# Altium schematic sheet SHT_6_I_Measure_07349-R5_L10.SchDoc
size B; CompanyName: Microchip Technology Inc.; Organization: Microchip Technology; Address1: 2355 West Chandler Blvd.; Address2: Chandler, AZ  85224; Address4: USA; SheetNumber: 7; SheetTotal: 9; SheetTitle: Current Measurement Front End; Time: Time
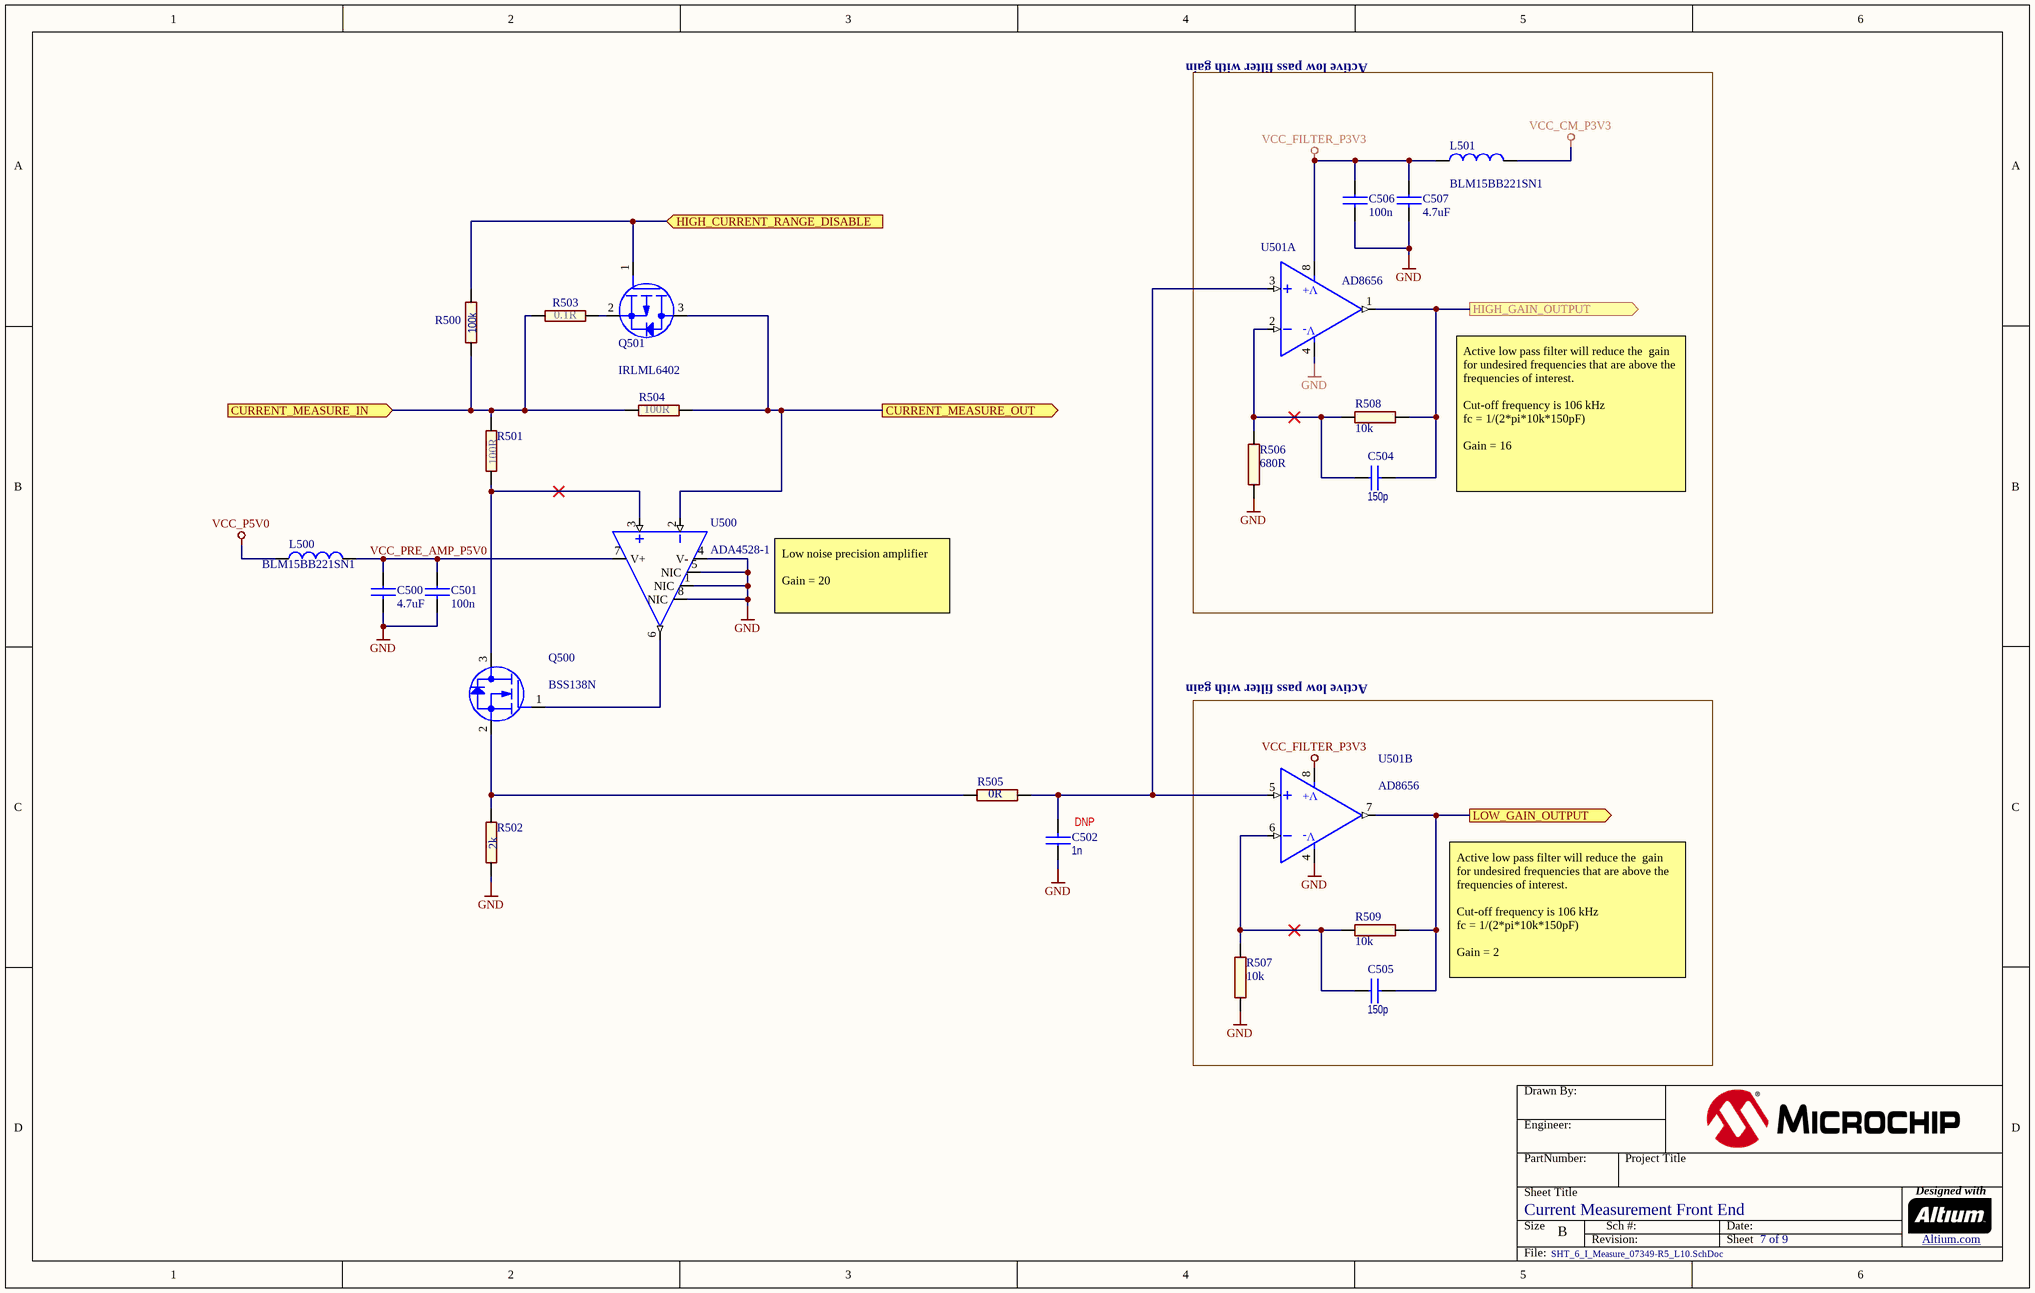
[diagram p0: SHT_6_I_Measure_07349-R5_L10.SchDoc]

## Parts
?  (no value)  (graphical)
C500  value 4.7uF  [AP1-00117]
C501  value 100n  [AP1-00053]  (hidden comment: CAP-NONPOL)
C502  value 1n  Placement: DNP  [AP1-00053]
C504  value 150p  [AP1-00053]
C505  value 150p  [AP1-00053]
C506  value 100n  [AP1-00053]
C507  value 4.7uF  [AP1-00117]
L500  value BLM15BB221SN1  [AP3-00028]
L501  value BLM15BB221SN1  [AP3-00028]
Q500  value BSS138N  [AP5-00002]
Q501  value IRLML6402  [AP5-00002]
R500  value 100k  [AP2-00011]
R501  value 100R  [AP2-00076]
R502  value 2k  [AP2-00076]
R503  value 0.1R  [AP2-00076]
R504  value 100R  [AP2-00076]
R505  value 0R  [AP2-00011]
R506  value 680R  [AP2-00011]
R507  value 10k  [AP2-00011]
R508  value 10k  [AP2-00011]
R509  value 10k  [AP2-00011]
U500  value ADA4528-1  [AP6-00100]
U501  value AD8656  [AP6-00100]  (parts A,B of 2)

## Blocks framed on the sheet
Active low pass filter with gain: C504 C506 C507 L501 R506 R508 U501

## Ports
CURRENT_MEASURE_IN (in), CURRENT_MEASURE_OUT (out), HIGH_CURRENT_RANGE_DISABLE (in), HIGH_GAIN_OUTPUT (out), LOW_GAIN_OUTPUT (out)

## Nets
GND: C500.2 C501.2 C502.1 C506.2 C507.2 R502.1 R506.1 R507.1 U500.1(NIC) U500.4(V-) U500.5(NIC) U500.8(NIC) U501.4(V-)
VCC_CM_P3V3: L501.1
VCC_FILTER_P3V3: C506.1 C507.1 L501.2 U501.8(V+)
VCC_P5V0: L500.1
CURRENT_MEASURE_IN: R500.1 R501.2 R503.1 R504.1 ; port CURRENT_MEASURE_IN
CURRENT_MEASURE_OUT: Q501.3(D) R504.2 U500.2(IN-) ; port CURRENT_MEASURE_OUT
HIGH_CURRENT_RANGE_DISABLE: Q501.1(G) R500.2 ; port HIGH_CURRENT_RANGE_DISABLE
HIGH_GAIN_OUTPUT: C504.2 R508.2 U501.1(OUTA) ; port HIGH_GAIN_OUTPUT
LOW_GAIN_OUTPUT: C505.2 R509.2 U501.7(OUTB) ; port LOW_GAIN_OUTPUT
VCC_PRE_AMP_P5V0: C500.1 C501.1 L500.2 U500.7(V+)
NetC502_2: C502.2 R505.1 U501.3(INA_+) U501.5(INB_+)
NetC504_1: C504.1 R506.2 R508.1 U501.2(INA_-)
NetC505_1: C505.1 R507.2 R509.1 U501.6(INB_-)
NetQ500_1: Q500.1(G) U500.6(OUT)
NetQ500_2: Q500.2(S) R502.2 R505.2
NetQ500_3: Q500.3(D) R501.1 U500.3(IN+)
NetQ501_2: Q501.2(S) R503.2

## Notes on the sheet
- Active low pass filter will reduce the  gain for undesired frequencies that are above the frequencies of interest.
  Cut-off frequency is 106 kHz
  fc = 1/(2*pi*10k*150pF)
  Gain = 16
- Low noise precision amplifier
  Gain = 20
- Active low pass filter with gain
- Active low pass filter will reduce the  gain for undesired frequencies that are above the frequencies of interest.
  Cut-off frequency is 106 kHz
  fc = 1/(2*pi*10k*150pF)
  Gain = 2
- Drawn By:
- Engineer:
- PartNumber:
- Project Title
- Sheet Title
- Size
- B
- Revision:
- Sch #:
- Date:
- Sheet
- Designed with
- Altium.com <http://go.altium.com/MicrochipLandingPage_Evaluation.html>
- File:

## Library data of the parts
? = Title Block B
C500 C507 = A01-0377: Ceramic capacitor, SMD 0603, X5R, 10V, 10% (de31036); PartGroup: Capacitors,Ceramic,SMD 0603; Manufacturer: tdk; MPN: C1608X5R1A475K; TemperatureRange: -55 - +85 deg C; ComponentStatus: 'Active (verified)'; Status: Active; Verified by: Lars Helge Mo; Verified date: 2005-12-15; AN: A01-0377; Tolerance: 10%; Height: 0.800000011920929; FootprintStatus: 'Active (Verified)'
C501 C506 = A01-0246: Ceramic capacitor, SMD 0402, X7R, 16V, +/-10%; PartGroup: Capacitors,Ceramic,SMD 0402; Manufacturer: Kemet; MPN: C0402C104K4RACTU; TemperatureRange: -55 - +125 deg C; ComponentStatus: 'Active (verified)'; Status: Active; Verified by: Lars Helge Mo; Verified date: 2005-12-15; AN: A01-0246; Tolerance: 16V, +/-10%; Height: 0.5; FootprintStatus: 'Active (Verified)'
C502 = A01-0038: Ceramic capacitor, SMD 0402, X7R, 50V, +/-10%; PartGroup: Capacitors,Ceramic,SMD 0402; Manufacturer: YAGEO CORP; MPN: CC0402KRX7R9BB102; TemperatureRange: -55 - +125 deg C; ComponentStatus: 'Active (verified)'; Status: Active; Verified by: Lars Helge Mo; Verified date: 2005-12-15; AN: A01-0038; Tolerance: 50V, +/-10%; Height: 0.550000011920929; FootprintStatus: 'Active (Verified)'
C504 C505 = A01-0028: Ceramic capacitor, SMD 0402, X7R, 50V, +/-10%; PartGroup: Capacitors,Ceramic,SMD 0402; Manufacturer: YAGEO CORP; MPN: CC0402KRX7R9BB151; TemperatureRange: -55 - +125 deg C; ComponentStatus: 'Active (verified)'; Status: Active; Verified by: Lars Helge Mo; Verified date: 2005-12-15; AN: A01-0028; Tolerance: 50V, +/-10%; Height: 0.550000011920929; FootprintStatus: 'Active (Verified)'
L500 L501 = A03-0037: SMD RF inductor 0402. Z=220Ohm (@100MHz), Max R(dc)=0.80Ohm, Max current=200mA; PartGroup: Inductors,EMI; Manufacturer: Murata; Tolerance: ±25%; TemperatureRange: -55°C to +125°C; ComponentStatus: 'Active (verified)'; Verified date: 2006-01-30; Verified by: Lars Helge Mo; Status: Active; AN: A03-0037; Height: 0.5; MPN: BLM15BB221SN1; FootprintStatus: 'Active (Verified)'
Q500 = A05-0140: Low leakage N-Channel MOSFET. 60V, 0.23A continuous, 0.92A Peak. RDS(ON) = 3.5Ohm@VGS=4.5V, VGS(th)<1.4V; PartGroup: Transistors,Small signal FET,SMD; Manufacturer: Infineon; TemperatureRange: -55  to +150 deg celcius; ComponentStatus: 'Active (verified)'; Status: New; AN: A05-0140; Height: 1.10000002384186; MPN: BSS138N; FootprintStatus: 'Active (Verified)'
Q501 = A05-0087: P-ch. MOSFET. -30V, -3.7A continuous,RDS(ON)=0.05Ohm@VGS=-4,5V, RDS(ON)=0.08Ohm@VGS=-2.5V; PartGroup: Transistors,Power FET,SMD; Manufacturer: International Rectifier; MPN: IRLML6402PBF; TemperatureRange: -55 - +150 deg C; ComponentStatus: 'Active (verified)'; Status: New; AN: A05-0087; Height: 1.14999997615814; FootprintStatus: 'Active (Verified)'
R500 = A02-0260: Thick film resistor, SMD 0402, 1/16W, 1%; PartGroup: Resistors,SMD,0402 1%; Manufacturer: ASJ; MPN: CR10-1003-FK; TemperatureRange: -55ï¿½ to +125ï¿½C; ComponentStatus: 'Active (verified)'; Status: Active; Verified by: Lars Helge Mo; Verified date: 2005-12-19; AN: A02-0260; Tolerance: 1 %; Height: 0.349999994039536; FootprintStatus: 'Active (Verified)'
R501 R504 = A02-0895: ERA-3YEB101V, metal film, 100R Â±0.1%, resistor in 0603 at 100mW, TEMPCO Â±25ppm/Â°C, Max V=75V; PartGroup: Resistors,Metal film,SMD Precision resistors; Manufacturer: Panasonic; MPN: ERA3YEB101V; ComponentStatus: 'Active (verified)'; Status: Active; Verified by: Lars Helge Mo; Verified date: 2005-12-19; AN: A02-0895; Height: 0.550000011920929; FootprintStatus: 'Active (Verified)'
R502 = A02-0081: Thick film resistor, SMD 0603, 1/10W, 1%; PartGroup: Resistors,SMD,0603 1%; Manufacturer: YAGEO CORP; MPN: RC0603FR-072KL; ComponentStatus: 'Active (verified)'; Status: Active; Verified by: Lars Helge Mo; Verified date: 2005-12-19; AN: A02-0081; Tolerance: 1 %; Height: 0.5; FootprintStatus: 'Active (Verified)'
R503 = A02-0896: WSL0603R1000FEA, metal strip resistor, 0.1 Ohm, +-1%, 0603 SMD, 1/10 W, TEMPCO +-75 ppm/Â°C; PartGroup: Resistors,Sense resistors,SMD Current Sense; Manufacturer: vishay; ComponentStatus: 'Active (verified)'; Status: Active; Verified by: Lars Helge Mo; Verified date: 2005-12-19; AN: A02-0896; Height: 0.330000013113022; MPN: WSL0603R1000FEA; FootprintStatus: 'Active (Verified)'
R505 = A02-0163: RES 0.0 OHM 1/16W 0402 SMD; PartGroup: Resistors,SMD,0402 1%; Manufacturer: (n/a); MPN: RMCF0402ZT0R00; Tolerance: 1 %; TemperatureRange: -55 - +125 deg C; ComponentStatus: 'Active (verified)'; Status: Active; Verified by: Lars Helge Mo; Verified date: 2005-12-19; AN: A02-0163; Height: 0.349999994039536; FootprintStatus: 'Active (Verified)'
R506 = A02-0208: Thick film resistor, SMD 0402, 1/16W, 1%; PartGroup: Resistors,SMD,0402 1%; Manufacturer: ASJ; MPN: CR10-6800-FK; TemperatureRange: -55 - +125 deg C; ComponentStatus: 'Active (verified)'; Status: Active; Verified by: Lars Helge Mo; Verified date: 2005-12-19; AN: A02-0208; Tolerance: 1 %; Height: 0.349999994039536; FootprintStatus: 'Active (Verified)'
R507-R509 = A02-0236: Thick film resistor, SMD 0402, 1/16W, 1%; PartGroup: Resistors,SMD,0402 1%; Manufacturer: Vishay; MPN: CRCW040210K0FKED; TemperatureRange: -55 - +125 deg C; ComponentStatus: 'Active (verified)'; Status: Active; Verified by: Lars Helge Mo; Verified date: 2005-12-19; AN: A02-0236; Tolerance: 1 %; Height: 0.349999994039536; FootprintStatus: 'Active (Verified)'
U500 = A06-1134: Precision OpAmp, Zero-Drift 0.015uV/K, ultra low noise 5.6nV/sqrt(Hz), Vo=2uV, GBW=4MHz, single supply 2.2V to 5.5V or dual supply +-1V to +-2.75V, rail to rail, unity gain stable; PartGroup: Integrated Circuits,General linear,OP-AMP; Manufacturer: Analog Devices; MPN: ADA4528-1ARMZ; ComponentStatus: 'Active (verified)'; Status: Active; Verified by: rmeslo; Verified date: 20.02.2006; AN: A06-1134; Height: 1.10000002384186; FootprintStatus: 'Active (Verified)'
U501 = A06-1125: AD8656, dual low noise precision OpAmp, rail-to-rail, low offset 250uV, GBP 28 MHz, 8MSOP; PartGroup: Integrated Circuits,General linear,OP-AMP; Manufacturer: Analog Devices; MPN: AD8656ARMZ; TemperatureRange: -40 to +125 deg celcius; ComponentStatus: 'Active (verified)'; Status: Active; Verified by: rmeslo; Verified date: 20.02.2006; AN: A06-1125; Height: 1.10000002384186; FootprintStatus: 'Active (Verified)'